# Altium schematic sheet thermocouple.SchDoc
size A
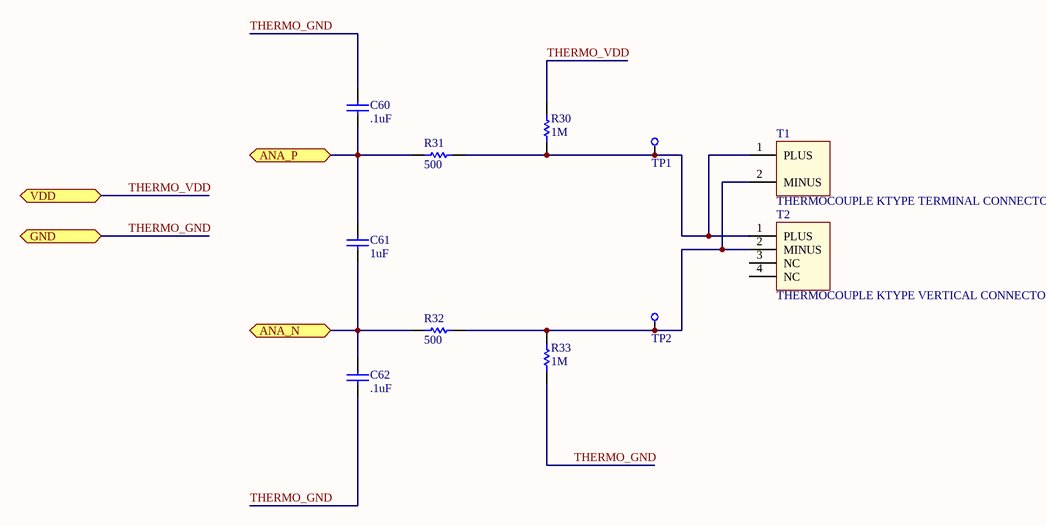
[diagram p0: thermocouple.SchDoc]

## Parts
C60  value .1uF  [0805]  (hidden comment: CAP)
C61  value 1uF  [0805]  (hidden comment: CAP)
C62  value .1uF  [0805]  (hidden comment: CAP)
R30  value 1M  [0805]  (hidden comment: RES)
R31  value 500  [0805]  (hidden comment: RES)
R32  value 500  [0805]  (hidden comment: RES)
R33  value 1M  [0805]  (hidden comment: RES)
T1  THERMOCOUPLE KTYPE TERMINAL CONNECTOR  [MKDSN2]
T2  THERMOCOUPLE KTYPE VERTICAL CONNECTOR  [PCC-SMP-V-K]
TP1  TEST_POINT  [TEST_POINT]  (value not drawn)
TP2  TEST_POINT  [TEST_POINT]  (value not drawn)

## Ports
ANA_N, ANA_P, GND, VDD

## Nets
ANA_N: C61.1 C62.2 R32.1 ; port ANA_N
ANA_P: C60.1 C61.2 R31.2 ; port ANA_P
THERMO_GND: C60.2 C62.1 R33.1 ; port GND
THERMO_VDD: R30.2 ; port VDD
NetR30_1: R30.1 R31.1 T1.1(PLUS) T2.1(PLUS) TP1.1
NetR32_2: R32.2 R33.2 T1.2(MINUS) T2.2(MINUS) TP2.1

Not connected (* = marked no-connect by the designer): T2 3(NC) 4(NC)

## Library data of the parts
C60-C62 = CAP: Tolerance: 5%; Voltage: 10V; Manufacturer: *; Manufacturer P/N: *; Tr: *; Distributor: Digi-Key; Distributor P/N: *
R30-R33 = RES: Tolerance: 5%; Tcr: *; Manufacturer: *; Manufacturer P/N: *; Tr: *; Alternatives: *; Voltage: *; Power: *; Distributor: Digi-Key; Distributor P/N: *
T1 = THERMOCOUPLE TERMINAL: Manufacturer: *; Manufacturer P/N: *
T2 = THERMOCOUPLE: Manufacturer: Newport; Manufacturer P/N: PCC-SMP-V-K-50; Distributor: Newport; Distributor P/N: PCC-SMP-V-K-50
TP1 TP2 = TEST_POINT: Thruhole Miniature Test Point; Manufacturer P/N: 5000; Manufacturer: Keystone Electronics Corp; Distributor: Digi-Key; Distributor P/N: 5000K-ND